# Altium schematic sheet Counter_INV.SchDoc
size A4; SheetNumber: 5; SheetTotal: 12
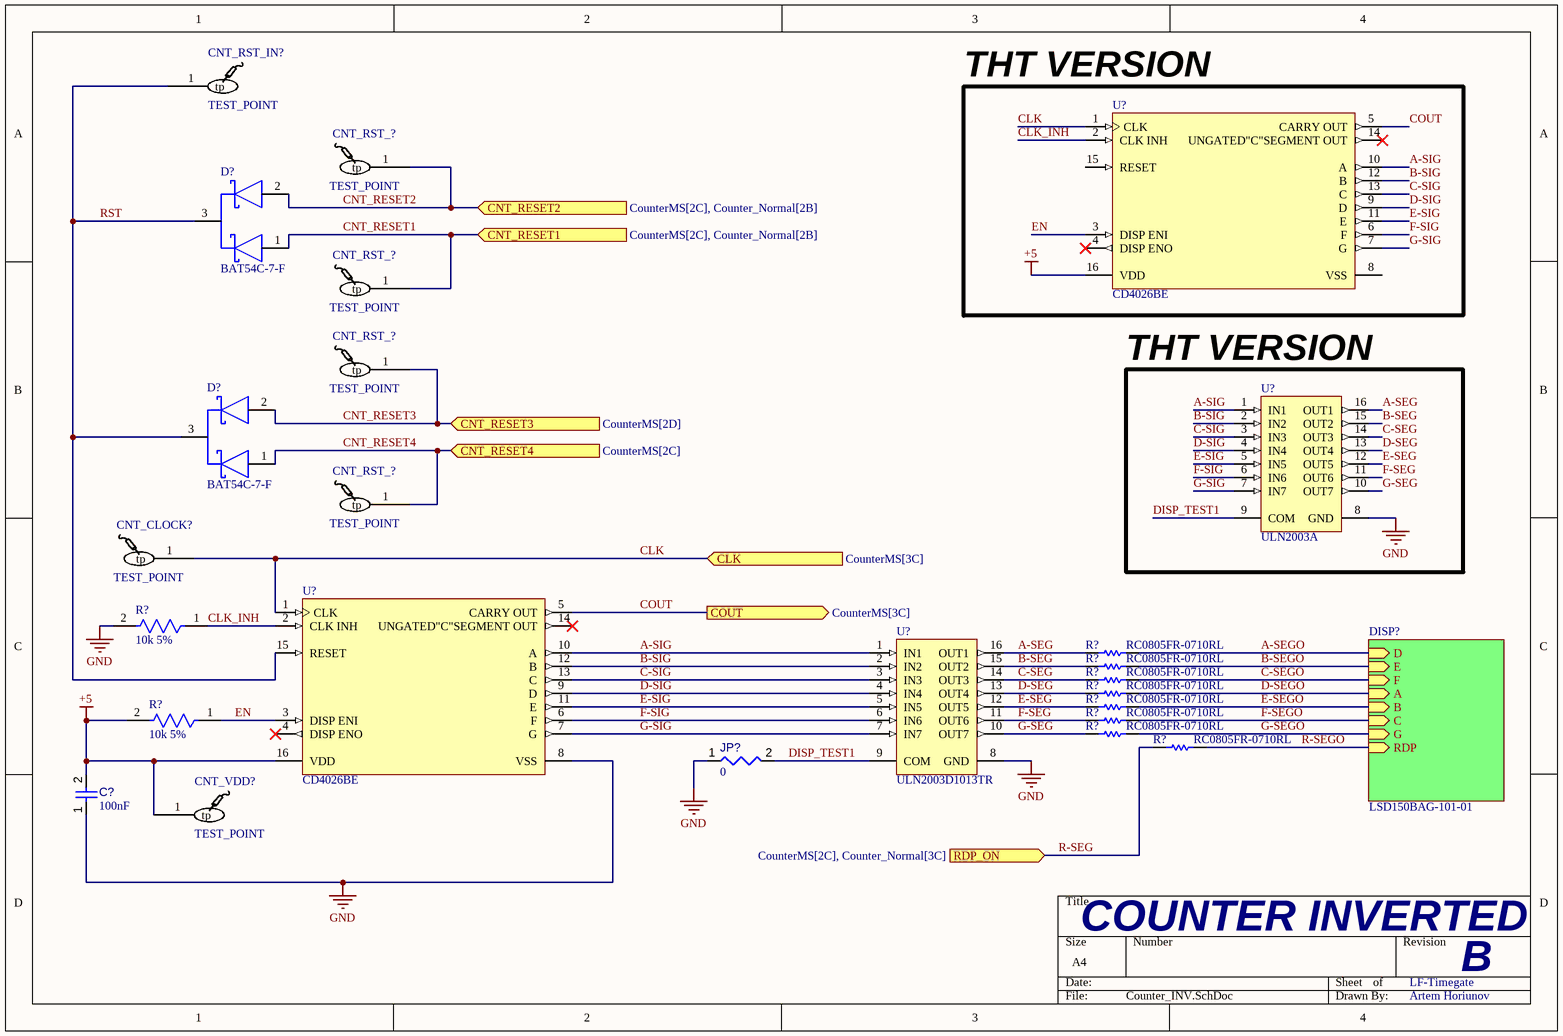
[diagram p0: Counter_INV.SchDoc]

## Parts
(Parts that share a designator on the sheet are numbered #1, #2 ... from top to bottom, then left to right.)
C?  value 100nF  [CAPC2013X95X50LL10T25]  (hidden comment: Capacitor 100 nF +/-10% 50 V 0805)
CNT_CLOCK?  TEST_POINT  [TestPoint-Footprint-1]
CNT_RST_?#1  TEST_POINT  [TestPoint-Footprint-1]
CNT_RST_?#2  TEST_POINT  [TestPoint-Footprint-1]
CNT_RST_?#3  TEST_POINT  [TestPoint-Footprint-1]
CNT_RST_?#4  TEST_POINT  [TestPoint-Footprint-1]
CNT_RST_IN?  TEST_POINT  [TestPoint-Footprint-1]
CNT_VDD?  TEST_POINT  [TestPoint-Footprint-1]
D?#1  BAT54C-7-F  [FP-SOT23-IPC_B]
D?#2  BAT54C-7-F  [FP-SOT23-IPC_B]
JP?  value 0  [RESC0603(1608)_L]  (hidden comment: Jumper 0603)
R?#1  10k 5%  [FP-RC0603-0_55-IPC_C]
R?#2  RC0805FR-0710RL  [RESC2013X60X35ML10T20]
R?#3  RC0805FR-0710RL  [RESC2013X60X35ML10T20]
R?#4  RC0805FR-0710RL  [RESC2013X60X35ML10T20]
R?#5  RC0805FR-0710RL  [RESC2013X60X35ML10T20]
R?#6  RC0805FR-0710RL  [RESC2013X60X35ML10T20]
R?#7  10k 5%  [FP-RC0603-0_55-IPC_C]
R?#8  RC0805FR-0710RL  [RESC2013X60X35ML10T20]
R?#9  RC0805FR-0710RL  [RESC2013X60X35ML10T20]
R?#10  RC0805FR-0710RL  [RESC2013X60X35ML10T20]
U?#1  CD4026BE  [N0016A]
U?#2  ULN2003A  [STM-DIP-16L]
U?#3  CD4026BE  [N0016A]
U?#4  ULN2003D1013TR  [STM-SO-16_M]

## Blocks framed on the sheet
THT VERSION: U?#1
THT VERSION: U?#2

## Sub-sheets
DISP? = LSD150BAG-101-01: E (in), D (in), C (in), B (in), A (in), RDP (in), F (in), G (in)

## Ports
CLK (in, see CounterMS[3C]), CNT_RESET1 (in, see CounterMS[2C], Counter_Normal[2B]), CNT_RESET2 (in, see CounterMS[2C], Counter_Normal[2B]), CNT_RESET3 (in, see CounterMS[2D]), CNT_RESET4 (in, see CounterMS[2C]), COUT (out, see CounterMS[3C]), RDP_ON (in, see CounterMS[2C], Counter_Normal[3C])

## Nets
+5: C?.2 CNT_VDD?.1(tp) R?#7.2 U?#1.16(VDD) U?#3.16(VDD)
GND: C?.1 JP?.1 R?#1.2 U?#2.8(GND) U?#3.8(VSS) U?#4.8(GND)
A-SEG: R?#2.1 U?#2.16(OUT1) U?#4.16(OUT1)
A-SEGO: R?#2.2 ; sheet DISP?/D
A-SIG: U?#1.10(A) U?#2.1(IN1) U?#3.10(A) U?#4.1(IN1)
B-SEG: R?#3.1 U?#2.15(OUT2) U?#4.15(OUT2)
B-SEGO: R?#3.2 ; sheet DISP?/E
B-SIG: U?#1.12(B) U?#2.2(IN2) U?#3.12(B) U?#4.2(IN2)
C-SEG: R?#4.1 U?#2.14(OUT3) U?#4.14(OUT3)
C-SEGO: R?#4.2 ; sheet DISP?/F
C-SIG: U?#1.13(C) U?#2.3(IN3) U?#3.13(C) U?#4.3(IN3)
CLK: CNT_CLOCK?.1(tp) U?#1.1(CLK) U?#3.1(CLK) ; port CLK
CLK_INH: R?#1.1 U?#1.2(CLK_INH) U?#3.2(CLK_INH)
CNT_RESET1: CNT_RST_?#2.1(tp) D?#1.1(1_ANODE) ; port CNT_RESET1
CNT_RESET2: CNT_RST_?#1.1(tp) D?#1.2(2_ANODE) ; port CNT_RESET2
CNT_RESET3: CNT_RST_?#3.1(tp) D?#2.2(2_ANODE) ; port CNT_RESET3
CNT_RESET4: CNT_RST_?#4.1(tp) D?#2.1(1_ANODE) ; port CNT_RESET4
COUT: U?#1.5(CARRY_OUT) U?#3.5(CARRY_OUT) ; port COUT
D-SEG: R?#5.1 U?#2.13(OUT4) U?#4.13(OUT4)
D-SEGO: R?#5.2 ; sheet DISP?/A
D-SIG: U?#1.9(D) U?#2.4(IN4) U?#3.9(D) U?#4.4(IN4)
DISP_TEST1: JP?.2 U?#2.9(COM) U?#4.9(COM)
E-SEG: R?#6.1 U?#2.12(OUT5) U?#4.12(OUT5)
E-SEGO: R?#6.2 ; sheet DISP?/B
E-SIG: U?#1.11(E) U?#2.5(IN5) U?#3.11(E) U?#4.5(IN5)
EN: R?#7.1 U?#1.3(DISP_ENI) U?#3.3(DISP_ENI)
F-SEG: R?#8.1 U?#2.11(OUT6) U?#4.11(OUT6)
F-SEGO: R?#8.2 ; sheet DISP?/C
F-SIG: U?#1.6(F) U?#2.6(IN6) U?#3.6(F) U?#4.6(IN6)
G-SEG: R?#9.1 U?#2.10(OUT7) U?#4.10(OUT7)
G-SEGO: R?#9.2 ; sheet DISP?/G
G-SIG: U?#1.7(G) U?#2.7(IN7) U?#3.7(G) U?#4.7(IN7)
R-SEG: R?#10.1 ; port RDP_ON
R-SEGO: R?#10.2 ; sheet DISP?/RDP
RST: CNT_RST_IN?.1(tp) D?#1.3(COMMON_CATHODE) D?#2.3(COMMON_CATHODE) U?#3.15(RESET)

Not connected (* = marked no-connect by the designer): U?#1 4(DISP_ENO)* 8(VSS) 14(UNGATED"C"SEGMENT_OUT)* 15(RESET); U?#3 4(DISP_ENO)* 14(UNGATED"C"SEGMENT_OUT)*

## Notes on the sheet
- COUNTER INVERTED
- LF-Timegate
- B
- Artem Horiunov

## Library data of the parts
C? = CMP-001-00018-6: Chip Capacitor, 100 nF, +/- 10%, 50 V, 0805 (2012 Metric); Capacitor Type: Ceramic; Voltage Rating: 50V; Pins: 2; Max Operating Temperature: 125°C; Min Operating Temperature: -55°C; Mounting Technology: SM; Case/Package: 0805; RoHS Compliant: True; Tolerance: 10%
CNT_CLOCK? CNT_RST_?#1-CNT_RST_?#4 CNT_RST_IN? CNT_VDD? = CMP-00001-5: Pad for testing
D?#1 D?#2 = CMP-12790-000084-1: DIODE ARRAY SCHOTTKY 30V SOT23-3; Max Reverse Current: 2uA; Power Dissipation: 200mW; Average Rectified Current: 200mA; Capacitance: 10pF; Peak Non-Repetitive Surge Current: 600mA; Forward Voltage: 800mV; Reverse Recovery Time: 5ns; Element Configuration: Common Cathode; Max Operating Temperature: 150°C; Max Reverse Voltage (DC): 30V; Power Rating: 200mW; Termination: SMD/SMT; REACH SVHC: No SVHC; Voltage Rating (DC): 30V; Series: -; Current Rating: 200mA; RoHS Compliant: Yes; Max Power Dissipation: 200mW; Case/Package: SOT-23; Max Repetitive Reverse Voltage (Vrrm): 30V; Width: 1.3mm; Min Operating Temperature: -65°C; Lead Free: Lead Free; Forward Current: 200mA; Number of Pins: 3; Contact Plating: Tin; Package Quantity: 3000; Length: 2.9mm; Radiation Hardening: No; Max Forward Surge Current (Ifsm): 600mA; Height: 1mm; Packaging: Tape and Reel; Mount: Surface Mount; Weight: 0.000282oz
JP? = CMP-009-00175-3: Pins: 2; Min Operating Temperature: -55°C; Max Operating Temperature: 155°C; Case/Package: 0603
R?#1 R?#7 = CMP-2100-03664-2: RES 10K OHM 1% 1/10W 0603; Voltage Rating: 75V; Voltage Rating (DC): 50V; Resistance: 10kR; Power Rating: 100mW; Temperature Coefficient: 100ppm/°C; Depth: 0.8mm; Termination: SMD/SMT; Resistor Type: Thick Film; Series: RC; Construction: Rectangular; Features: Moisture Resistant; Packaging: Tape and Reel; Min Operating Temperature: -55°C; Number of Terminations: 2; Lead Pitch: 0.3mm; RoHS Compliant: Yes; Case/Package: 0603; Resistance Tolerance: 1%; Military Standard: Not; Weight: 7.1E-05oz; Number of Pins: 2; Tolerance: 1%; Length: 1.6mm; Case Code (Imperial): 0603; Lead Free: Lead Free; Width: 0.8mm; Max Power Dissipation: 100mW; Height: 0.45mm; Max Operating Temperature: 155°C; Case Code (Metric): 1608; Size Code: 0603
R?#2-R?#6 R?#8-R?#10 = CMP-2100-03670-1: Chip Resistor, 10 Ohm, +/- 1%, 0.125 W, -55 to 155 degC, 0805 (2012 Metric), RoHS, Tape and Reel; Manufacturer: Yageo; Resistance: 10Ohm; Power Rating: 125mW; Voltage Rating: 150V; Temperature Coefficient: 200ppm/degreesC; Number of Pins: 2; REACH SVHC: NoSVHC; Datasheet Version: Rev. 5, 10/2016; Max Operating Temperature: 155degC; Manufacturer URL: http://www.yageo.com/; Case Code (Imperial): 0805; Package Description: 2-Pin Surface Mounted Device, Body 2 x 1.25 mm; Case Code (Metric): 2012; Length: 2mm; RoHSCompliant: true; Max Power Dissipation: 125mW; Depth: 1.25mm; Packaging: TapeandReel; Height: 0.5mm; Package Reference: 0805; Package Quantity: 1; Tolerance: 1%; Termination: SMD/SMT; Min Operating Temperature: -55degC; Lead Free: LeadFree; Width: 1.25mm; Voltage Rating (DC): 150V; Datasheet URL: http://www.yageo.com/NewPortal/yageodocoutput?fileName=/pdf/R-Chip/PYu-RC_Group_51_RoHS_L_5.pdf; Composition: ThickFilm; Number of Terminations: 2; Case/Package: 0805
U?#1 U?#3 = CMP-1623-00561-2: CMOS Decade Counter/Divider with Decoded 7-Segment Display Outputs and Display Enable, N0016A, TUBE; Manufacturer: Texas Instruments; ICC @ Nom Voltage(Max)(mA): 0.03; tpd @ Nom Voltage(Max)(ns): 250; F @ Nom Voltage(Max)(Mhz): 8; Bits(#): 7; VCC(Max)(V): 18; VCC(Min)(V): 3; Output Drive (IOL/IOH)(Max)(mA): 1.5/-1.5; Inputs: 1; Rating: Catalog; Technology Family: CD4000; Schmitt Trigger: No; Voltage(Nom)(V): 5,10,15; DatasheetVersion: SCHS031B; Operating Temperature Range(C): -55 to 125; Code_JEDEC: MS-001; Input Type: CMOS; Output Type: CMOS; Type: Decade; Generic Part Number: CD4026B; PackageReference: N0016A; Function: Counter
U?#2 = CMP-2000-07351-1: Seven Darlington Array, 50 V, 0.5 A, -40 to 85 degC, 16-Pin DIP, RoHS, Tube; Manufacturer: STMicroelectronics; Transistor Polarity: NPN; VOUT: 50V; No. of Pins: 16Pins; SVHC: NoSVHC(17-Dec-2015); DC Current Gain hFE: 1000hFE; Output Current: 0.5A; DC Collector Current: 500mA; Transistor Case Style: DIP; Package Reference: DIP-16L; Automotive Qualification Standard: -; Mounting Technology: ThroughHole; Power Dissipation Pd: -; Collector Emitter Voltage V(br)ceo: 50V; Datasheet URL: http://www2.st.com/content/ccc/resource/technical/document/datasheet/f3/6e/c8/64/4d/b3/4e/38/CD00001244.pdf/files/CD00001244.pdf/jcr:content/translations/en.CD00001244.pdf; Manufacturer URL: http://www.st.com/; PartNumber: ULN2003A; MSL: MSL2-1year; Product Range: -; Package Description: 16-Pin DIP, Body 19.7 x 7.1 mm, Pitch 2.54 mm; Operating Temperature Max: 85°C; Datasheet Version: Rev. 8, 06/2012
U?#4 = CMP-2000-05374-1: Seven NPN Darlington Array Transistor, 50 V, 500 mA, -40 to 85 degC, 8-Pin SOIC, RoHS, Tape and Reel; Manufacturer: STMicroelectronics; Collector Emitter Voltage V(br)ceo: 50V; SVHC: NoSVHC(17-Dec-2015); DC Current Gain hFE: 1000hFE; DC Collector Current: 500mA; No. of Pins: 16Pins; Package Reference: SO-16; Transistor Polarity: NPN; Transistor Case Style: SOIC; Datasheet URL: https://datasheet.ciiva.com/1193/1690348-1193460.pdf; Package Description: 16-Pin Small Outline Integrated Circuit, Body 9.9 x 3.9 mm, Pitch 1.27 mm; Datasheet Version: Rev. 8, 06/2012; Power Dissipation Pd: -; Product Range: -; Operating Temperature Max: 85degC; MSL: MSL1-Unlimited; Manufacturer URL: http://www.st.com/; Automotive Qualification Standard: -